# Altium schematic sheet switch.SchDoc
size A3; Organization: Yandex; Address2: 11 Timura Frunze st., building 2; Release_Date: yyyy-mm-dd; Language: en; Organization2: Self Driving Group LLC
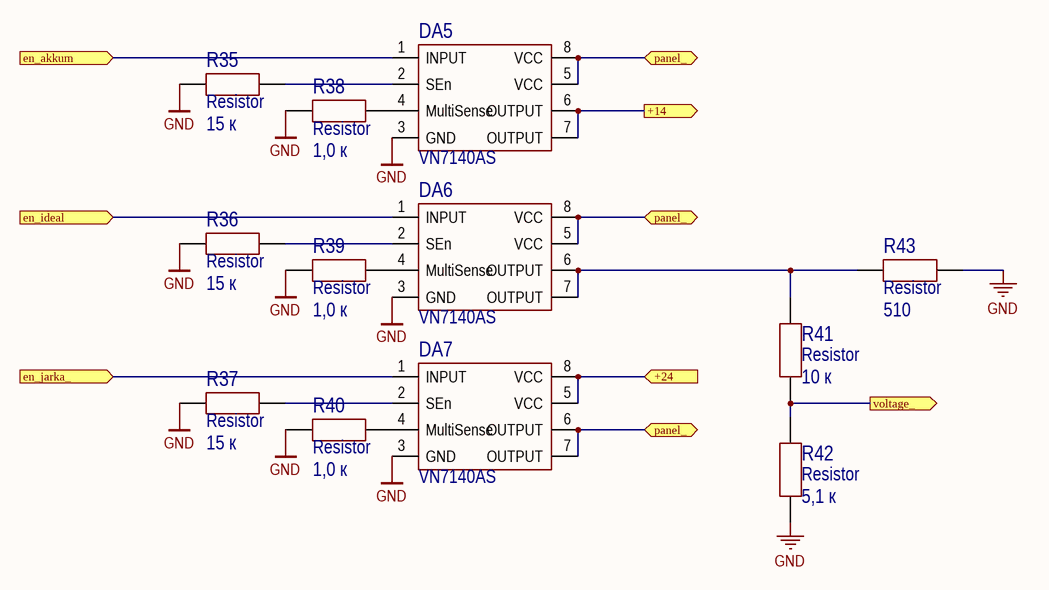
[diagram p0: switch.SchDoc]

## Parts
DA5  VN7140AS  [SOP8]
DA6  VN7140AS  [SOP8]
DA7  VN7140AS  [SOP8]
R35  Resistor  value 15 к  [0603R]
R36  Resistor  value 15 к  [0603R]
R37  Resistor  value 15 к  [0603R]
R38  Resistor  value 1,0 к  [0603R]
R39  Resistor  value 1,0 к  [0603R]
R40  Resistor  value 1,0 к  [0603R]
R41  Resistor  value 10 к  [0603R]
R42  Resistor  value 5,1 к  [0603R]
R43  Resistor  value 510  [2512R]

## Ports
+14 (out), +24 (in), en_akkum (in), en_ideal (in), en_jarka_ (in), panel_ (bidir), voltage_ (out)

## Nets
GND: DA5.3(GND) DA6.3(GND) DA7.3(GND) R35.1 R36.1 R37.1 R38.1 R39.1 R40.1 R42.1 R43.2
+14: DA5.6(OUTPUT) DA5.7(OUTPUT) ; port +14
+24: DA7.5(VCC) DA7.8(VCC) ; port +24
en_akkum: DA5.1(INPUT) ; port en_akkum
en_ideal: DA6.1(INPUT) ; port en_ideal
en_jarka_: DA7.1(INPUT) ; port en_jarka_
panel_: DA5.5(VCC) DA5.8(VCC) DA6.5(VCC) DA6.8(VCC) DA7.6(OUTPUT) DA7.7(OUTPUT) ; port panel_
voltage_: R41.1 R42.2 ; port voltage_
NetDA5_2: DA5.2(SEn) R35.2
NetDA5_4: DA5.4(MultiSense) R38.2
NetDA6_2: DA6.2(SEn) R36.2
NetDA6_4: DA6.4(MultiSense) R39.2
NetDA6_6: DA6.6(OUTPUT) DA6.7(OUTPUT) R41.2 R43.1
NetDA7_2: DA7.2(SEn) R37.2
NetDA7_4: DA7.4(MultiSense) R40.2

## Notes on the sheet
- 1
- 2
- 3
- 4
- 5
- 6
- 7
- 8
- A
- B
- C
- D
- E
- Responsible department
- Technical reference
- Document type
- Document status
- F
- Legal owner
- Created by
- Schematic drawing
- Title, Supplementary title
- CONFIDENTIAL
- Yandex
- Commercial secret
- Self Driving Group LLC
- Approved by
- Doc Rev.
- Date of Issue
- Lang.
- Sheet
- A3

## Library data of the parts
DA5-DA7 = VN7140AS: Силовой ключ верхнего плеча с аналоговой обратной связью MultiSense автомобильного применения; Part Number: VN7140AS
R35-R37 = Resistor_15k_1_0603: Резистор номиналом 15 кОм и точностью 1%; Power: *; Part Number: Resistor_15k_1_0603; Tolerance: 1%
R38-R40 = Resistor_1.0k_1_0603: Резистор номиналом 1,0 кОм и точностью 1%; Power: *; Part Number: Resistor_1.0k_1_0603; Tolerance: 1%
R41 = Resistor_10k_1_0603: Резистор номиналом 10 кОм и точностью 1%; Power: *; Part Number: Resistor_10k_1_0603; Tolerance: 1%
R42 = Resistor_5.1k_1_0603: Резистор номиналом 5,1 кОм и точностью 1%; Power: *; Part Number: Resistor_5.1k_1_0603; Tolerance: 1%
R43 = Resistor_510_1_0603: Резистор номиналом 510 Ом и точностью 1%; Power: *; Part Number: Resistor_510_1_0603; Tolerance: 1%